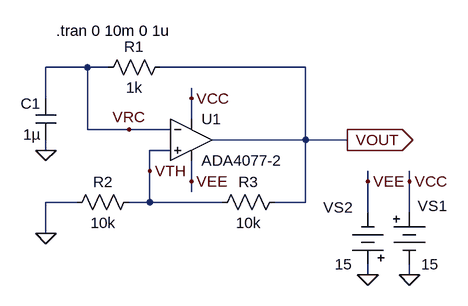
[diagram p0: schematic fig-01-03-01.asc]
fig-01-03-01.asc, the LTspice schematic file:
Version 4
SHEET 1 880 680
WIRE 48 64 -16 64
WIRE 80 64 48 64
WIRE 384 64 160 64
WIRE -16 112 -16 64
WIRE 208 112 208 96
WIRE 208 144 208 112
WIRE 48 160 48 64
WIRE 112 160 48 160
WIRE 176 160 112 160
WIRE 384 176 384 64
WIRE 384 176 240 176
WIRE 448 176 384 176
WIRE -16 192 -16 176
WIRE 176 192 144 192
WIRE 144 224 144 192
WIRE 208 240 208 208
WIRE 480 240 480 224
WIRE 544 240 544 224
WIRE 208 256 208 240
WIRE 32 272 -16 272
WIRE 144 272 144 224
WIRE 144 272 112 272
WIRE 256 272 144 272
WIRE 384 272 384 176
WIRE 384 272 336 272
WIRE 480 288 480 240
WIRE 544 288 544 240
WIRE -16 320 -16 272
WIRE 480 384 480 368
WIRE 544 384 544 368
FLAG -16 320 0
FLAG 448 176 VOUT
IOPIN 448 176 Out
FLAG -16 192 0
FLAG 112 160 VRC
FLAG 144 224 VTH
FLAG 480 384 0
FLAG 544 384 0
FLAG 480 240 VEE
FLAG 544 240 VCC
FLAG 208 112 VCC
FLAG 208 240 VEE
SYMBOL res 128 256 R90
WINDOW 0 0 56 VBottom 2
WINDOW 3 32 56 VTop 2
SYMATTR InstName R2
SYMATTR Value 10k
SYMBOL res 352 256 R90
WINDOW 0 0 56 VBottom 2
WINDOW 3 32 56 VTop 2
SYMATTR InstName R3
SYMATTR Value 10k
SYMBOL res 176 48 R90
WINDOW 0 0 56 VBottom 2
WINDOW 3 32 56 VTop 2
SYMATTR InstName R1
SYMATTR Value 1k
SYMBOL cap 0 176 R180
WINDOW 0 24 56 Left 2
WINDOW 3 24 8 Left 2
SYMATTR InstName C1
SYMATTR Value 1µ
SYMBOL Misc\\battery 544 272 R0
WINDOW 0 13 6 Left 2
WINDOW 3 18 96 Left 2
SYMATTR InstName VS1
SYMATTR Value 15
SYMBOL Misc\\battery 480 384 R180
WINDOW 0 24 104 Left 2
WINDOW 3 24 16 Left 2
SYMATTR InstName VS2
SYMATTR Value 15
SYMBOL Opamps\\ADA4077-2 208 112 R0
SYMATTR InstName U1
TEXT 0 8 Left 2 !.tran 0 10m 0 1u

The netlist it stands for:
* fig-01-03-01.asc
R2 VTH 0 10k
R3 VOUT VTH 10k
R1 VOUT VRC 1k
C1 0 VRC 1µ
VS1 VCC 0 15
VS2 0 VEE 15
XU1 VTH VRC VCC VEE VOUT ADA4077-2  ; pins In+ In- V+ V- OUT
.tran 0 10m 0 1u
.backanno
.end